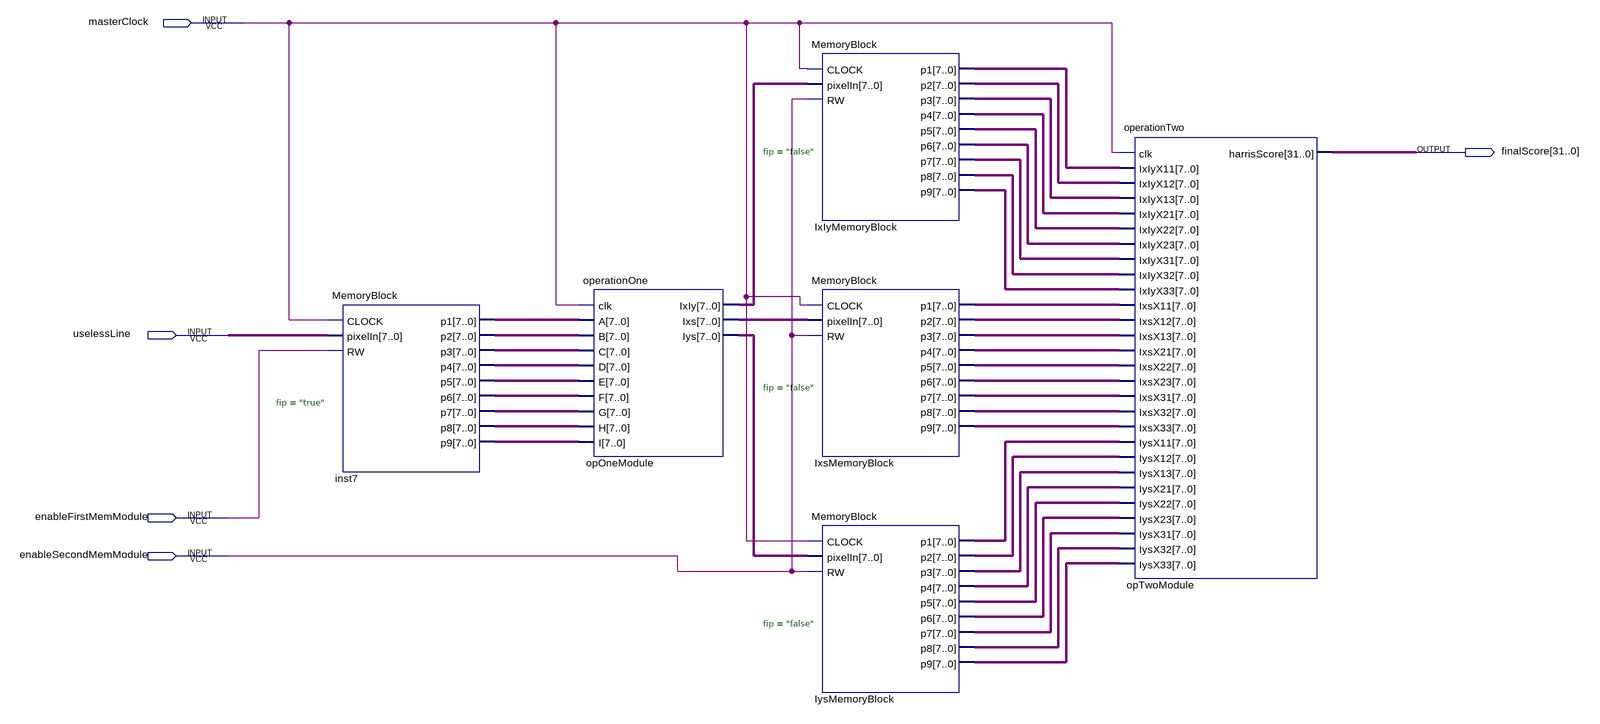
[diagram p0: schematic sheet]
// Quartus schematic ORB-SLAM.bdf as structural Verilog: 6 symbols, 5 pins
module \ORB-SLAM  (
  input  masterClock,
  input  uselessLine,
  input  enableFirstMemModule,
  input  enableSecondMemModule,
  output [31:0] finalScore
);

  wire [7:0] inst7_p1, inst7_p2, inst7_p3, inst7_p4, inst7_p5, inst7_p6, inst7_p7, inst7_p8, inst7_p9,
       IxIyMemoryBlock_p1, IxIyMemoryBlock_p2, IxIyMemoryBlock_p3, IxIyMemoryBlock_p4, IxIyMemoryBlock_p5,
       IxIyMemoryBlock_p6, IxIyMemoryBlock_p7, IxIyMemoryBlock_p8, IxIyMemoryBlock_p9, IxsMemoryBlock_p1,
       IxsMemoryBlock_p2, IxsMemoryBlock_p3, IxsMemoryBlock_p4, IxsMemoryBlock_p5, IxsMemoryBlock_p6,
       IxsMemoryBlock_p7, IxsMemoryBlock_p8, IxsMemoryBlock_p9, IysMemoryBlock_p1, IysMemoryBlock_p2,
       IysMemoryBlock_p3, IysMemoryBlock_p4, IysMemoryBlock_p5, IysMemoryBlock_p6, IysMemoryBlock_p7,
       IysMemoryBlock_p8, IysMemoryBlock_p9, opOneModule_ixiy, opOneModule_ixs, opOneModule_iys, undriven;

  MemoryBlock #(.fip("true")) inst7 (
    .CLOCK(masterClock), .pixelIn(undriven), .RW(enableFirstMemModule), .p1(inst7_p1), .p2(inst7_p2),
    .p3(inst7_p3), .p4(inst7_p4), .p5(inst7_p5), .p6(inst7_p6), .p7(inst7_p7), .p8(inst7_p8), .p9(inst7_p9));
  operationOne opOneModule (
    .clk(masterClock), .A(inst7_p1), .B(inst7_p2), .C(inst7_p3), .D(inst7_p4), .E(inst7_p5), .F(inst7_p6),
    .G(inst7_p7), .H(inst7_p8), .I(inst7_p9), .IxIy(opOneModule_ixiy), .Ixs(opOneModule_ixs),
    .Iys(opOneModule_iys));
  MemoryBlock #(.fip("false")) IxIyMemoryBlock (
    .CLOCK(masterClock), .pixelIn(opOneModule_ixiy), .RW(enableSecondMemModule), .p1(IxIyMemoryBlock_p1),
    .p2(IxIyMemoryBlock_p2), .p3(IxIyMemoryBlock_p3), .p4(IxIyMemoryBlock_p4), .p5(IxIyMemoryBlock_p5),
    .p6(IxIyMemoryBlock_p6), .p7(IxIyMemoryBlock_p7), .p8(IxIyMemoryBlock_p8), .p9(IxIyMemoryBlock_p9));
  MemoryBlock #(.fip("false")) IxsMemoryBlock (
    .CLOCK(masterClock), .pixelIn(opOneModule_ixs), .RW(enableSecondMemModule), .p1(IxsMemoryBlock_p1),
    .p2(IxsMemoryBlock_p2), .p3(IxsMemoryBlock_p3), .p4(IxsMemoryBlock_p4), .p5(IxsMemoryBlock_p5),
    .p6(IxsMemoryBlock_p6), .p7(IxsMemoryBlock_p7), .p8(IxsMemoryBlock_p8), .p9(IxsMemoryBlock_p9));
  MemoryBlock #(.fip("false")) IysMemoryBlock (
    .CLOCK(masterClock), .pixelIn(opOneModule_iys), .RW(enableSecondMemModule), .p1(IysMemoryBlock_p1),
    .p2(IysMemoryBlock_p2), .p3(IysMemoryBlock_p3), .p4(IysMemoryBlock_p4), .p5(IysMemoryBlock_p5),
    .p6(IysMemoryBlock_p6), .p7(IysMemoryBlock_p7), .p8(IysMemoryBlock_p8), .p9(IysMemoryBlock_p9));
  operationTwo opTwoModule (
    .clk(masterClock), .IxIyX11(IxIyMemoryBlock_p1), .IxIyX12(IxIyMemoryBlock_p2),
    .IxIyX13(IxIyMemoryBlock_p3), .IxIyX21(IxIyMemoryBlock_p4), .IxIyX22(IxIyMemoryBlock_p5),
    .IxIyX23(IxIyMemoryBlock_p6), .IxIyX31(IxIyMemoryBlock_p7), .IxIyX32(IxIyMemoryBlock_p8),
    .IxIyX33(IxIyMemoryBlock_p9), .IxsX11(IxsMemoryBlock_p1), .IxsX12(IxsMemoryBlock_p2),
    .IxsX13(IxsMemoryBlock_p3), .IxsX21(IxsMemoryBlock_p4), .IxsX22(IxsMemoryBlock_p5),
    .IxsX23(IxsMemoryBlock_p6), .IxsX31(IxsMemoryBlock_p7), .IxsX32(IxsMemoryBlock_p8),
    .IxsX33(IxsMemoryBlock_p9), .IysX11(IysMemoryBlock_p1), .IysX12(IysMemoryBlock_p2),
    .IysX13(IysMemoryBlock_p3), .IysX21(IysMemoryBlock_p4), .IysX22(IysMemoryBlock_p5),
    .IysX23(IysMemoryBlock_p6), .IysX31(IysMemoryBlock_p7), .IysX32(IysMemoryBlock_p8),
    .IysX33(IysMemoryBlock_p9), .harrisScore(finalScore));
endmodule
